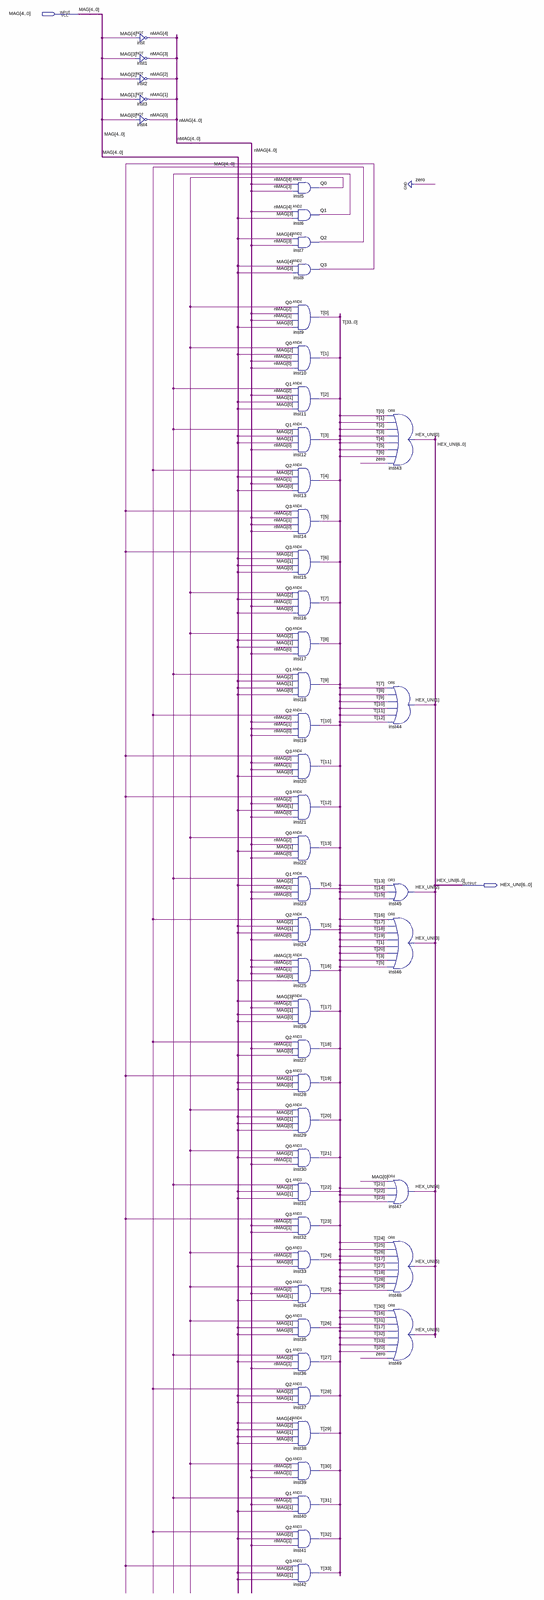
[diagram p0: schematic sheet, whole]
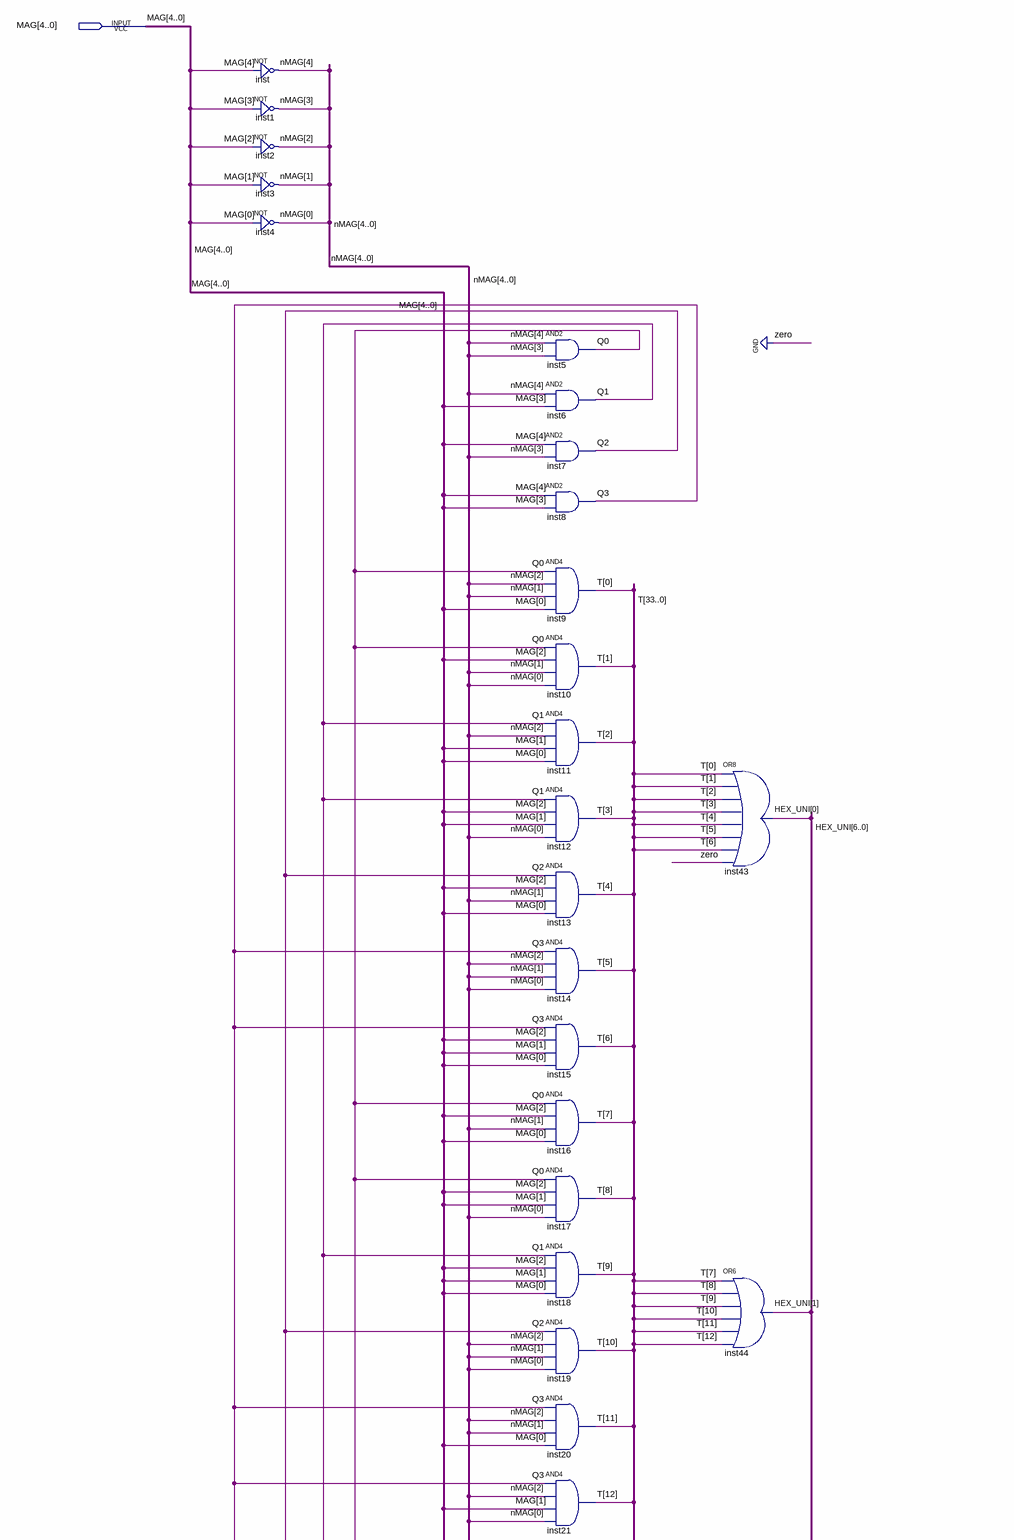
[diagram p1: schematic sheet, upper part]
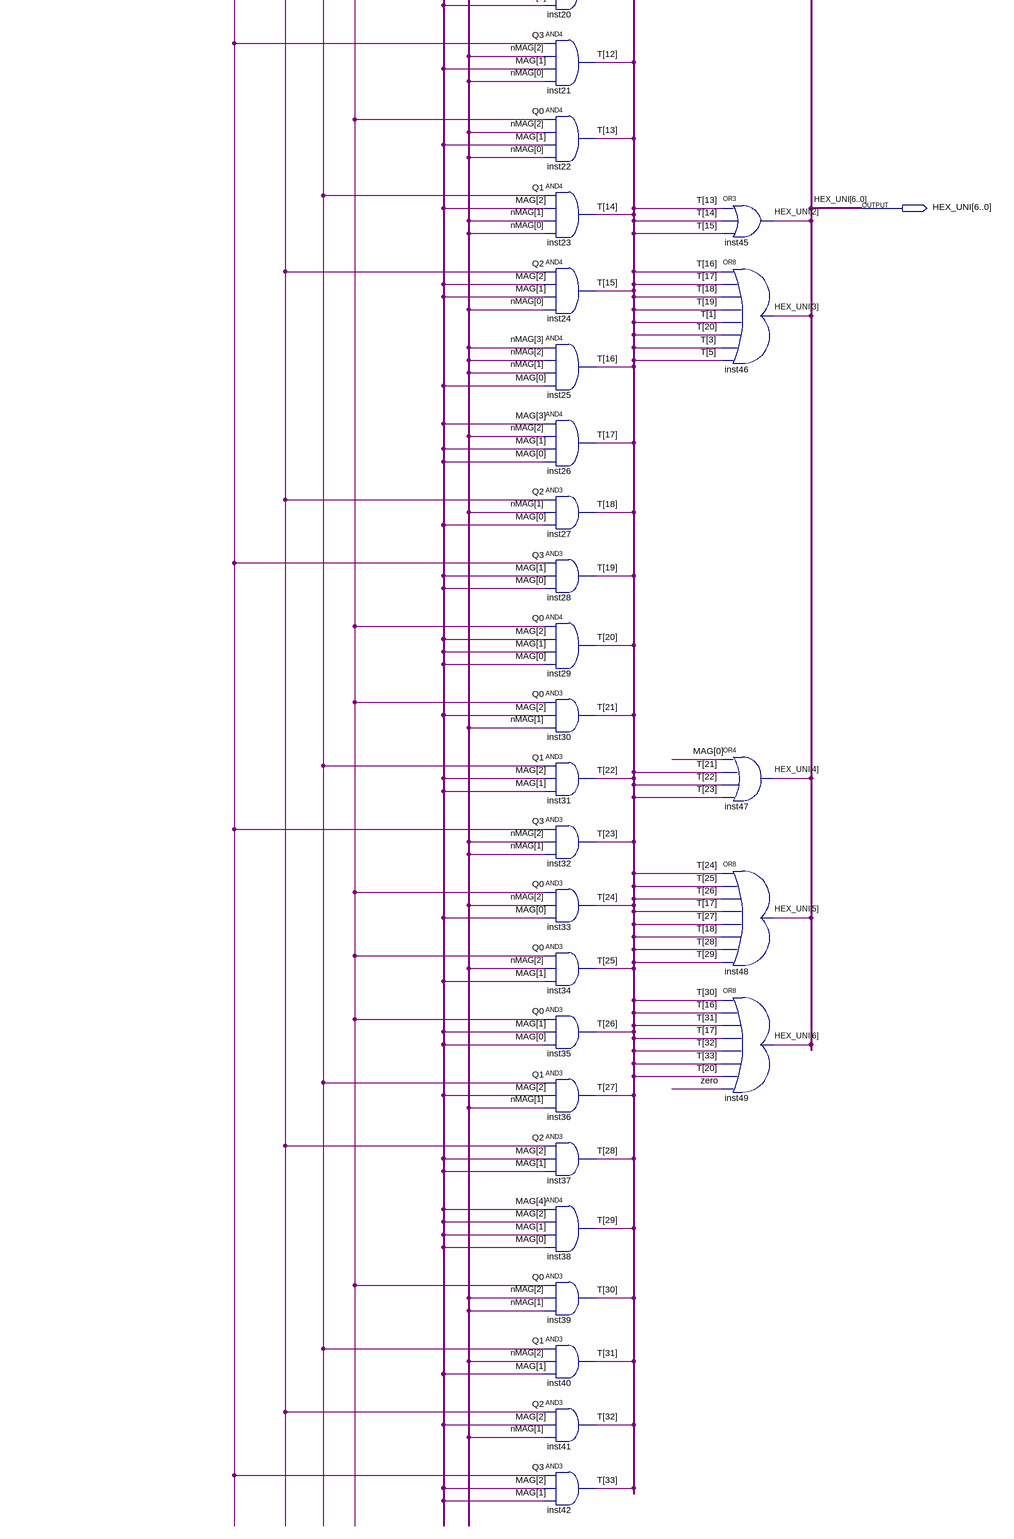
[diagram p2: schematic sheet, lower part]
// Quartus schematic decof7_unidade.bdf as structural Verilog: 50 symbols, 2 pins
module decof7_unidade (
  input  [4:0] MAG,
  output [6:0] HEX_UNI
);

  wire Q0, Q1, Q2, Q3;
  wire [4:0] nMAG;
  wire [33:0] T;

  not inst (nMAG[4], MAG[4]);
  not inst1 (nMAG[3], MAG[3]);
  not inst2 (nMAG[2], MAG[2]);
  not inst3 (nMAG[1], MAG[1]);
  not inst4 (nMAG[0], MAG[0]);
  and inst5 (Q0, nMAG[4], nMAG[3]);
  and inst6 (Q1, nMAG[4], MAG[3]);
  and inst7 (Q2, MAG[4], nMAG[3]);
  and inst8 (Q3, MAG[4], MAG[3]);
  and inst9 (T[0], Q0, nMAG[2], nMAG[1], MAG[0]);
  and inst10 (T[1], Q0, MAG[2], nMAG[1], nMAG[0]);
  and inst11 (T[2], Q1, nMAG[2], MAG[1], MAG[0]);
  and inst12 (T[3], Q1, MAG[2], MAG[1], nMAG[0]);
  and inst13 (T[4], Q2, MAG[2], nMAG[1], MAG[0]);
  and inst14 (T[5], Q3, nMAG[2], nMAG[1], nMAG[0]);
  and inst15 (T[6], Q3, MAG[2], MAG[1], MAG[0]);
  and inst16 (T[7], Q0, MAG[2], nMAG[1], MAG[0]);
  and inst17 (T[8], Q0, MAG[2], MAG[1], nMAG[0]);
  and inst18 (T[9], Q1, MAG[2], MAG[1], MAG[0]);
  and inst19 (T[10], Q2, nMAG[2], nMAG[1], nMAG[0]);
  and inst20 (T[11], Q3, nMAG[2], nMAG[1], MAG[0]);
  and inst21 (T[12], Q3, nMAG[2], MAG[1], nMAG[0]);
  and inst22 (T[13], Q0, nMAG[2], MAG[1], nMAG[0]);
  and inst23 (T[14], Q1, MAG[2], nMAG[1], nMAG[0]);
  and inst24 (T[15], Q2, MAG[2], MAG[1], nMAG[0]);
  and inst25 (T[16], nMAG[3], nMAG[2], nMAG[1], MAG[0]);
  and inst26 (T[17], MAG[3], nMAG[2], MAG[1], MAG[0]);
  and inst27 (T[18], Q2, nMAG[1], MAG[0]);
  and inst28 (T[19], Q3, MAG[1], MAG[0]);
  and inst29 (T[20], Q0, MAG[2], MAG[1], MAG[0]);
  and inst30 (T[21], Q0, MAG[2], nMAG[1]);
  and inst31 (T[22], Q1, MAG[2], MAG[1]);
  and inst32 (T[23], Q3, nMAG[2], nMAG[1]);
  and inst33 (T[24], Q0, nMAG[2], MAG[0]);
  and inst34 (T[25], Q0, nMAG[2], MAG[1]);
  and inst35 (T[26], Q0, MAG[1], MAG[0]);
  and inst36 (T[27], Q1, MAG[2], nMAG[1]);
  and inst37 (T[28], Q2, MAG[2], MAG[1]);
  and inst38 (T[29], MAG[4], MAG[2], MAG[1], MAG[0]);
  and inst39 (T[30], Q0, nMAG[2], nMAG[1]);
  and inst40 (T[31], Q1, nMAG[2], MAG[1]);
  and inst41 (T[32], Q2, MAG[2], nMAG[1]);
  and inst42 (T[33], Q3, MAG[2], MAG[1]);
  or inst43 (HEX_UNI[0], T[0], T[1], T[2], T[3], T[4], T[5], T[6], 1'b0);
  or inst44 (HEX_UNI[1], T[7], T[8], T[9], T[10], T[11], T[12]);
  or inst45 (HEX_UNI[2], T[13], T[14], T[15]);
  or inst46 (HEX_UNI[3], T[16], T[17], T[18], T[19], T[1], T[20], T[3], T[5]);
  or inst47 (HEX_UNI[4], MAG[0], T[21], T[22], T[23]);
  or inst48 (HEX_UNI[5], T[24], T[25], T[26], T[17], T[27], T[18], T[28], T[29]);
  or inst49 (HEX_UNI[6], T[30], T[16], T[31], T[17], T[32], T[33], T[20], 1'b0);
endmodule
